# Altium schematic sheet XX_FPGA_BANK502.SchDoc
size 420 x 297 mm; Address1: Address1; Address2: Address2; Address3: Address3; Address4: Address4; DocumentNumber: АБВГ.123456.001 Э3; SheetNumber: 3; SheetTotal: 5; Scale: 1:1; DocumentType: Схема электрическая принципиальная; FirstReferrence: АБВГ.123456.001
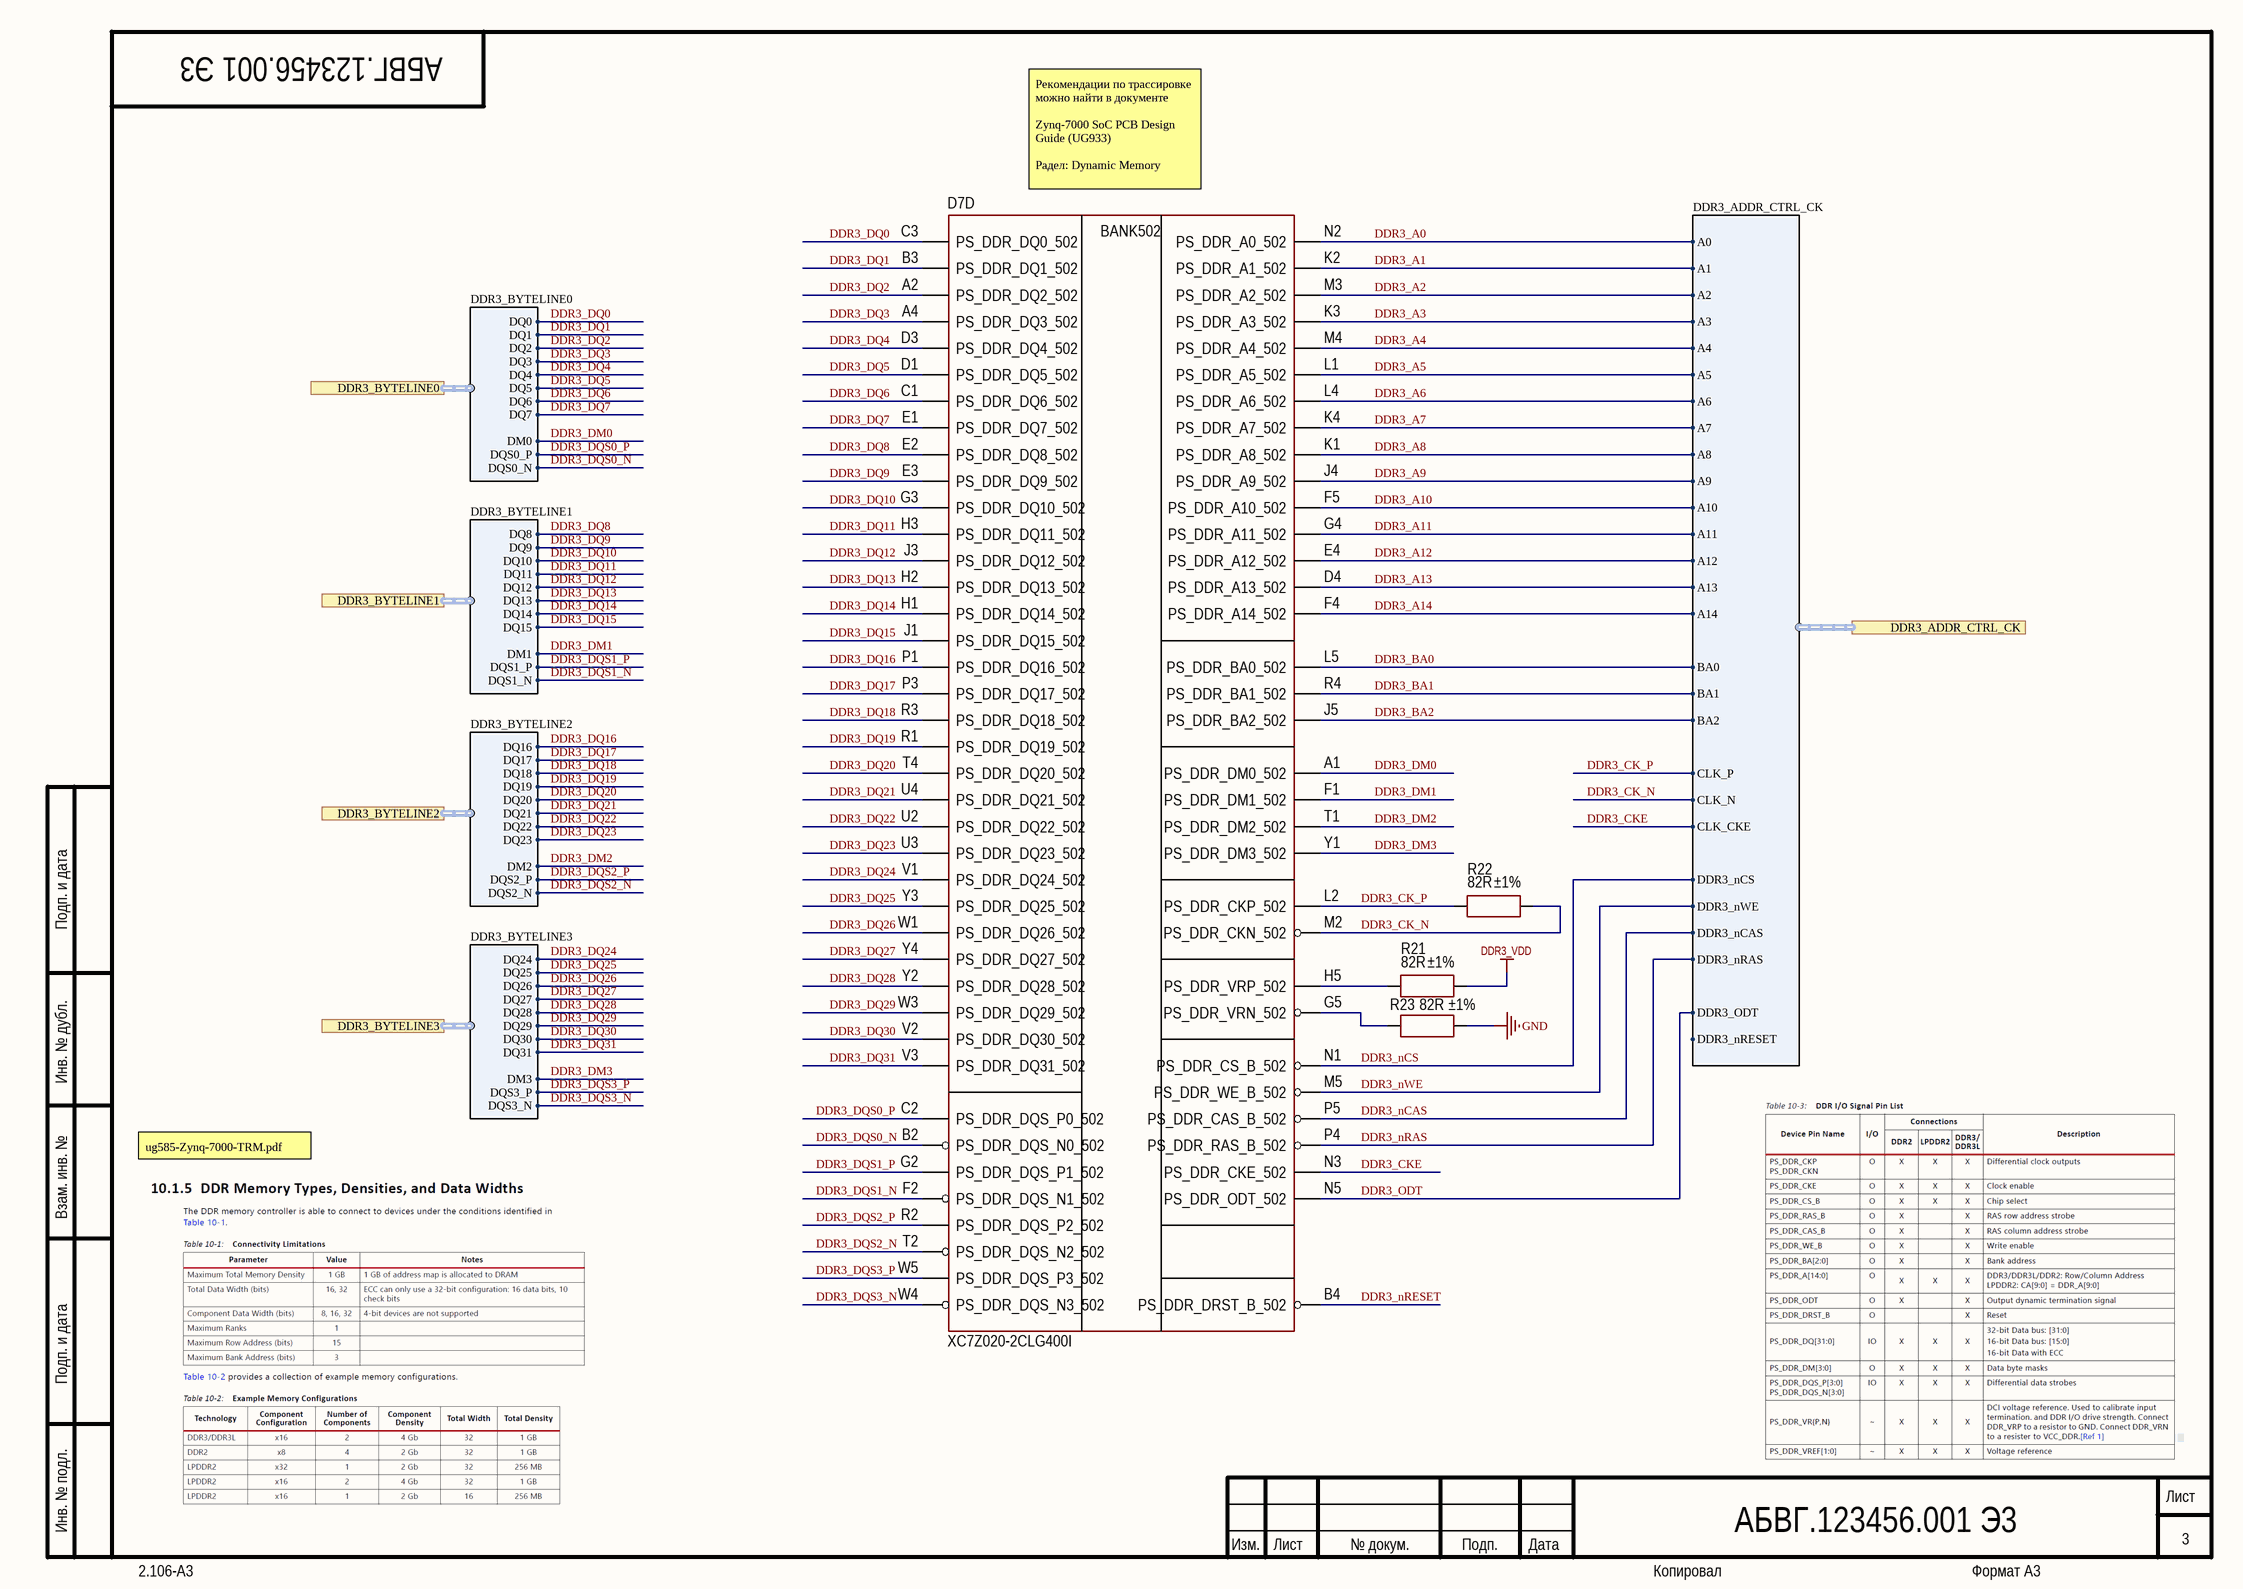
[diagram p0: XX_FPGA_BANK502.SchDoc]

## Parts
D7  PartNumber: XC7Z020-2CLG400I  [IC:BGA400C80P20X20_1700X1700X147]  (part D of 9)
R21  value 82R  Tolerance: ±1%  [RES: 0402]
R22  value 82R  Tolerance: ±1%  [RES: 0402]
R23  value 82R  Tolerance: ±1%  [RES: 0402]

## Ports
DDR3_ADDR_CTRL_CK (harness DDR3_ADDR_CTRL_CK), DDR3_BYTELINE0 (harness DDR3_BYTELINE0), DDR3_BYTELINE1 (harness DDR3_BYTELINE1), DDR3_BYTELINE2 (harness DDR3_BYTELINE2), DDR3_BYTELINE3 (harness DDR3_BYTELINE3)

## Harnesses
DDR3_BYTELINE0: DQ0, DQ1, DQ2, DQ3, DQ4, DQ5, DQ6, DQ7, DM0, DQS0_P, DQS0_N
DDR3_BYTELINE1: DQ8, DQ9, DQ10, DQ11, DQ12, DQ13, DQ14, DQ15, DM1, DQS1_P, DQS1_N
DDR3_BYTELINE2: DQ16, DQ17, DQ18, DQ19, DQ20, DQ21, DQ22, DQ23, DM2, DQS2_P, DQS2_N
DDR3_BYTELINE3: DQ24, DQ25, DQ26, DQ27, DQ28, DQ29, DQ30, DQ31, DM3, DQS3_P, DQS3_N
DDR3_ADDR_CTRL_CK: A0, A1, A2, A3, A4, A5, A6, A7, A8, A9, A10, A11, A12, A13, A14, BA0, BA1, BA2, CLK_P, CLK_N, CLK_CKE, DDR3_nCS, DDR3_nRAS, DDR3_nWE, DDR3_nCAS, DDR3_ODT, DDR3_nRESET

## Nets
DDR3_VDD: R21.1
GND: R23.2
DDR3_A0: D7.N2(PS_DDR_A0_502) ; port DDR3_ADDR_CTRL_CK.A0
DDR3_A1: D7.K2(PS_DDR_A1_502) ; port DDR3_ADDR_CTRL_CK.A1
DDR3_A2: D7.M3(PS_DDR_A2_502) ; port DDR3_ADDR_CTRL_CK.A2
DDR3_A3: D7.K3(PS_DDR_A3_502) ; port DDR3_ADDR_CTRL_CK.A3
DDR3_A4: D7.M4(PS_DDR_A4_502) ; port DDR3_ADDR_CTRL_CK.A4
DDR3_A5: D7.L1(PS_DDR_A5_502) ; port DDR3_ADDR_CTRL_CK.A5
DDR3_A6: D7.L4(PS_DDR_A6_502) ; port DDR3_ADDR_CTRL_CK.A6
DDR3_A7: D7.K4(PS_DDR_A7_502) ; port DDR3_ADDR_CTRL_CK.A7
DDR3_A8: D7.K1(PS_DDR_A8_502) ; port DDR3_ADDR_CTRL_CK.A8
DDR3_A9: D7.J4(PS_DDR_A9_502) ; port DDR3_ADDR_CTRL_CK.A9
DDR3_A10: D7.F5(PS_DDR_A10_502) ; port DDR3_ADDR_CTRL_CK.A10
DDR3_A11: D7.G4(PS_DDR_A11_502) ; port DDR3_ADDR_CTRL_CK.A11
DDR3_A12: D7.E4(PS_DDR_A12_502) ; port DDR3_ADDR_CTRL_CK.A12
DDR3_A13: D7.D4(PS_DDR_A13_502) ; port DDR3_ADDR_CTRL_CK.A13
DDR3_A14: D7.F4(PS_DDR_A14_502) ; port DDR3_ADDR_CTRL_CK.A14
DDR3_BA0: D7.L5(PS_DDR_BA0_502) ; port DDR3_ADDR_CTRL_CK.BA0
DDR3_BA1: D7.R4(PS_DDR_BA1_502) ; port DDR3_ADDR_CTRL_CK.BA1
DDR3_BA2: D7.J5(PS_DDR_BA2_502) ; port DDR3_ADDR_CTRL_CK.BA2
DDR3_CK_N: D7.M2(PS_DDR_CKN_502) R22.1 ; port DDR3_ADDR_CTRL_CK.CLK_N
DDR3_CK_P: D7.L2(PS_DDR_CKP_502) R22.2 ; port DDR3_ADDR_CTRL_CK.CLK_P
DDR3_CKE: D7.N3(PS_DDR_CKE_502) ; port DDR3_ADDR_CTRL_CK.CLK_CKE
DDR3_DM0: D7.A1(PS_DDR_DM0_502) ; port DDR3_BYTELINE0.DM0
DDR3_DM1: D7.F1(PS_DDR_DM1_502) ; port DDR3_BYTELINE1.DM1
DDR3_DM2: D7.T1(PS_DDR_DM2_502) ; port DDR3_BYTELINE2.DM2
DDR3_DM3: D7.Y1(PS_DDR_DM3_502) ; port DDR3_BYTELINE3.DM3
DDR3_DQ0: D7.C3(PS_DDR_DQ0_502) ; port DDR3_BYTELINE0.DQ0
DDR3_DQ1: D7.B3(PS_DDR_DQ1_502) ; port DDR3_BYTELINE0.DQ1
DDR3_DQ2: D7.A2(PS_DDR_DQ2_502) ; port DDR3_BYTELINE0.DQ2
DDR3_DQ3: D7.A4(PS_DDR_DQ3_502) ; port DDR3_BYTELINE0.DQ3
DDR3_DQ4: D7.D3(PS_DDR_DQ4_502) ; port DDR3_BYTELINE0.DQ4
DDR3_DQ5: D7.D1(PS_DDR_DQ5_502) ; port DDR3_BYTELINE0.DQ5
DDR3_DQ6: D7.C1(PS_DDR_DQ6_502) ; port DDR3_BYTELINE0.DQ6
DDR3_DQ7: D7.E1(PS_DDR_DQ7_502) ; port DDR3_BYTELINE0.DQ7
DDR3_DQ8: D7.E2(PS_DDR_DQ8_502) ; port DDR3_BYTELINE1.DQ8
DDR3_DQ9: D7.E3(PS_DDR_DQ9_502) ; port DDR3_BYTELINE1.DQ9
DDR3_DQ10: D7.G3(PS_DDR_DQ10_502) ; port DDR3_BYTELINE1.DQ10
DDR3_DQ11: D7.H3(PS_DDR_DQ11_502) ; port DDR3_BYTELINE1.DQ11
DDR3_DQ12: D7.J3(PS_DDR_DQ12_502) ; port DDR3_BYTELINE1.DQ12
DDR3_DQ13: D7.H2(PS_DDR_DQ13_502) ; port DDR3_BYTELINE1.DQ13
DDR3_DQ14: D7.H1(PS_DDR_DQ14_502) ; port DDR3_BYTELINE1.DQ14
DDR3_DQ15: D7.J1(PS_DDR_DQ15_502) ; port DDR3_BYTELINE1.DQ15
DDR3_DQ16: D7.P1(PS_DDR_DQ16_502) ; port DDR3_BYTELINE2.DQ16
DDR3_DQ17: D7.P3(PS_DDR_DQ17_502) ; port DDR3_BYTELINE2.DQ17
DDR3_DQ18: D7.R3(PS_DDR_DQ18_502) ; port DDR3_BYTELINE2.DQ18
DDR3_DQ19: D7.R1(PS_DDR_DQ19_502) ; port DDR3_BYTELINE2.DQ19
DDR3_DQ20: D7.T4(PS_DDR_DQ20_502) ; port DDR3_BYTELINE2.DQ20
DDR3_DQ21: D7.U4(PS_DDR_DQ21_502) ; port DDR3_BYTELINE2.DQ21
DDR3_DQ22: D7.U2(PS_DDR_DQ22_502) ; port DDR3_BYTELINE2.DQ22
DDR3_DQ23: D7.U3(PS_DDR_DQ23_502) ; port DDR3_BYTELINE2.DQ23
DDR3_DQ24: D7.V1(PS_DDR_DQ24_502) ; port DDR3_BYTELINE3.DQ24
DDR3_DQ25: D7.Y3(PS_DDR_DQ25_502) ; port DDR3_BYTELINE3.DQ25
DDR3_DQ26: D7.W1(PS_DDR_DQ26_502) ; port DDR3_BYTELINE3.DQ26
DDR3_DQ27: D7.Y4(PS_DDR_DQ27_502) ; port DDR3_BYTELINE3.DQ27
DDR3_DQ28: D7.Y2(PS_DDR_DQ28_502) ; port DDR3_BYTELINE3.DQ28
DDR3_DQ29: D7.W3(PS_DDR_DQ29_502) ; port DDR3_BYTELINE3.DQ29
DDR3_DQ30: D7.V2(PS_DDR_DQ30_502) ; port DDR3_BYTELINE3.DQ30
DDR3_DQ31: D7.V3(PS_DDR_DQ31_502) ; port DDR3_BYTELINE3.DQ31
DDR3_DQS0_N: D7.B2(PS_DDR_DQS_N0_502) ; port DDR3_BYTELINE0.DQS0_N
DDR3_DQS0_P: D7.C2(PS_DDR_DQS_P0_502) ; port DDR3_BYTELINE0.DQS0_P
DDR3_DQS1_N: D7.F2(PS_DDR_DQS_N1_502) ; port DDR3_BYTELINE1.DQS1_N
DDR3_DQS1_P: D7.G2(PS_DDR_DQS_P1_502) ; port DDR3_BYTELINE1.DQS1_P
DDR3_DQS2_N: D7.T2(PS_DDR_DQS_N2_502) ; port DDR3_BYTELINE2.DQS2_N
DDR3_DQS2_P: D7.R2(PS_DDR_DQS_P2_502) ; port DDR3_BYTELINE2.DQS2_P
DDR3_DQS3_N: D7.W4(PS_DDR_DQS_N3_502) ; port DDR3_BYTELINE3.DQS3_N
DDR3_DQS3_P: D7.W5(PS_DDR_DQS_P3_502) ; port DDR3_BYTELINE3.DQS3_P
DDR3_nCAS: D7.P5(PS_DDR_CAS_B_502) ; port DDR3_ADDR_CTRL_CK.DDR3_nCAS
DDR3_nCS: D7.N1(PS_DDR_CS_B_502) ; port DDR3_ADDR_CTRL_CK.DDR3_nCS
DDR3_nRAS: D7.P4(PS_DDR_RAS_B_502) ; port DDR3_ADDR_CTRL_CK.DDR3_nRAS
DDR3_nRESET: D7.B4(PS_DDR_DRST_B_502)
DDR3_nWE: D7.M5(PS_DDR_WE_B_502) ; port DDR3_ADDR_CTRL_CK.DDR3_nWE
DDR3_ODT: D7.N5(PS_DDR_ODT_502) ; port DDR3_ADDR_CTRL_CK.DDR3_ODT
NetD7_G5: D7.G5(PS_DDR_VRN_502) R23.1
NetD7_H5: D7.H5(PS_DDR_VRP_502) R21.2

## Notes on the sheet
- (near D7) Рекомендации по трассировке можно найти в документе
  Zynq-7000 SoC PCB Design Guide (UG933)
  Радел: Dynamic Memory
- ug585-Zynq-7000-TRM.pdf
- Подп. и дата
- Инв. № дубл.
- Взам. инв. №
- Инв. № подл.
- Изм.
- Лист
- № докум.
- Подп.
- Дата
- 2.106-A3
- Копировал
- Формат А3
- (in symbol XC7Z020_CLG400ABX22, part D) BANK502

## Library data of the parts
D7 = XC7Z020_CLG400ABX22: FPGA XILINX Zynq XC7Z020; Manufacturer: AMD/XILINX; ValueManufacturerPartNumber: IC FPGA, Zynq, , , , 1.15...1.25V, 0...+85°C, CSPBGA-400; Supply: 1.15...1.25V; HelpURL: https://www.lcsc.com/product-detail/Programmable-Logic-Device-CPLDs-FPGAs_AMD-XILINX-XC7Z020-2CLG400I_C569043.html; Package: CSPBGA-400; ComponentType: IC FPGA; Temperature: 0...+85°C; Series: Zynq
R21-R23 = Resistor_0402: Manufacturer: Yageo; PartNumber: RC0402FR-0782RL; ValueManufacturerPartNumber: Resistor film, 82R, ±1%, 0402, 0.063W, -55...+125°C; TypeResistor: Resistor film; Power: 0.063W; Package: 0402; HelpURL: https://www.lcsc.com/product-detail/Chip-Resistor-Surface-Mount_YAGEO-RC0402FR-0782RL_C163453.html; Temperature: -55...+125°C